# EAGLE design main (EAGLE 9.2.0)
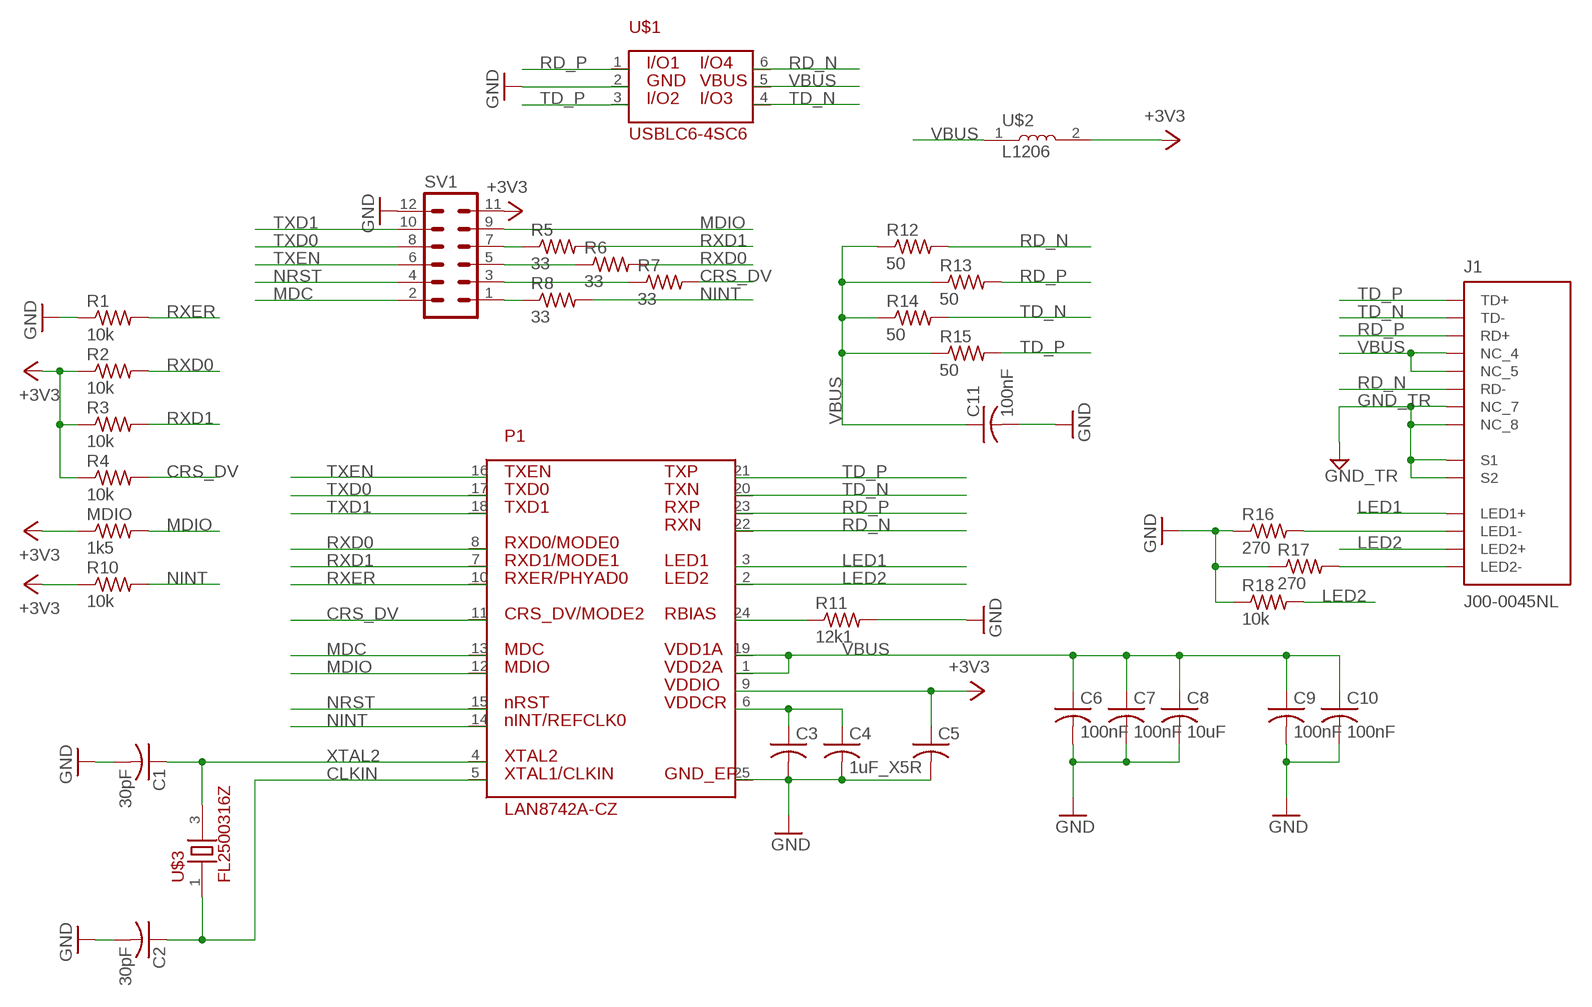
[diagram p0: schematic, sheet 1]

## Parts
C1  30pF  C-USC0603  [C0603]
C2  30pF  C-USC0603  [C0603]
C3  C-USC0603  [C0603]
C4  1uF_X5R  C-USC0603  [C0603]
C5  C-USC0603  [C0603]
C6  100nF  C-USC0603  [C0603]
C7  100nF  C-USC0603  [C0603]
C8  10uF  C-USC1206K  [C1206K]
C9  100nF  C-USC0603  [C0603]
C10  100nF  C-USC0603  [C0603]
C11  100nF  C-USC0603  [C0603]
J1  J00-0045NL  [PULSE_J00-0045NL]
MDIO  1k5  R-US_R0603  [R0603]
P1  LAN8742A-CZ  [LAN8742A-CZ]
R1  10k  R-US_R0603  [R0603]
R2  10k  R-US_R0603  [R0603]
R3  10k  R-US_R0603  [R0603]
R4  10k  R-US_R0603  [R0603]
R5  33  R-US_R0603  [R0603]
R6  33  R-US_R0603  [R0603]
R7  33  R-US_R0603  [R0603]
R8  33  R-US_R0603  [R0603]
R10  10k  R-US_R0603  [R0603]
R11  12k1  R-US_R0603  [R0603]
R12  50  R-US_R0603  [R0603]
R13  50  R-US_R0603  [R0603]
R14  50  R-US_R0603  [R0603]
R15  50  R-US_R0603  [R0603]
R16  270  R-US_R0603  [R0603]
R17  270  R-US_R0603  [R0603]
R18  10k  R-US_R0603  [R0603]
SV1  MA06-2  [MA06-2]
U$1  USBLC6-4SC6  [SOT95P280X145-6N]
U$2  L1206  [RESC3216X125N]
U$3  FL2500316Z  [FL2500316Z]

## Nets
+3V3 [power]: C5.1 MDIO.1 P1.9 R2.1 R3.1 R4.1 R10.1 SV1.11 U$2.2
CLKIN: C2.1 P1.5 U$3.1
CRS_DV: P1.11 R4.2 R7.2
GND [power]: C1.2 C2.2 C3.2 C4.2 C5.2 C6.2 C7.2 C8.2 C9.2 C10.2 C11.2 P1.25 R1.1 R11.2 R16.1 R17.1 R18.1 SV1.12 U$1.2
GND_TR [power]: J1.7(NC_7) J1.8(NC_8) J1.S1 J1.S2
LED1: J1.9(LED1+) P1.3
LED2: J1.12(LED2+) P1.2 R18.2
MDC: P1.13 SV1.2
MDIO: MDIO.2 P1.12 SV1.9
N$1: R5.1 SV1.7
N$2: R6.1 SV1.5
N$3: P1.24 R11.1
N$4: R7.1 SV1.3
N$5: R8.1 SV1.1
N$6: C3.1 C4.1 P1.6
N$9: J1.10(LED1-) R16.2
N$10: J1.11(LED2-) R17.2
NINT: P1.14 R8.2 R10.2
NRST: P1.15 SV1.4
RD_N [diff pairs]: J1.6(RD-) P1.22 R12.2 U$1.6
RD_P [diff pairs]: J1.3(RD+) P1.23 R13.2 U$1.1
RXD0: P1.8 R2.2 R6.2
RXD1: P1.7 R3.2 R5.2
RXER: P1.10 R1.2
TD_N [diff pairs]: J1.2(TD-) P1.20 R14.2 U$1.4
TD_P [diff pairs]: J1.1(TD+) P1.21 R15.2 U$1.3
TXD0: P1.17 SV1.8
TXD1: P1.18 SV1.10
TXEN: P1.16 SV1.6
VBUS: C6.1 C7.1 C8.1 C9.1 C10.1 C11.1 J1.4(NC_4) J1.5(NC_5) P1.1 P1.19 R12.1 R13.1 R14.1 R15.1 U$1.5 U$2.1
XTAL2: C1.1 P1.4 U$3.3

## Library data of the parts
C1-C11 = resistor:C-US: CAPACITOR, American symbol
J1 = J00-0045NL:J00-0045NL: Conn RJ-45 Integrated Magnetics F 8 POS 2.54mm Solder RA Thru-Hole 12 Terminal 1 Port Cat 5/Cat 6; AVAILABILITY: Unavailable; DESCRIPTION: Conn RJ-45 Integrated Magnetics F 8 POS 2.54mm Solder RA Thru-Hole 12 Terminal 1 Port Cat 5/Cat 6; MF: Pulse Electronics; MP: J00-0045NL; PACKAGE: None; PRICE: None
MDIO R1-R8 R10-R18 = resistor:R-US_: RESISTOR, American symbol
P1 = LAN8742A-CZ:LAN8742A-CZ: 24-pin, high-performance 10/100 Ethernet transceiver, 3.3V supply; A_MAX: 1.0; A_MIN: 0.8; A_NOM: 0.9; B_MAX: 0.3; B_MIN: 0.18; B_NOM: 0.24; D2_MAX: 2.6; D2_MIN: 2.4; D2_NOM: 2.5; D_MAX: 4.1; D_MIN: 3.9; D_NOM: 4.0; E2_MAX: 2.6; E2_MIN: 2.4; E2_NOM: 2.5; ENOM: 0.5; E_MAX: 4.1; E_MIN: 3.9; E_NOM: 4.0; L_MAX: 0.45; L_MIN: 0.35; L_NOM: 0.4; MANUFACTURER: Microchip; PIN_COUNT_D: 6.0; PIN_COUNT_E: 6.0; SNAPEDA_PACKAGE_ID: 37385
SV1 = con-lstb:MA06-2: PIN HEADER; OC_FARNELL: unknown; OC_NEWARK: unknown
U$1 = SOT95P280X145-6N:USBLC6-4SC6: Very low capacitance ESD protection
U$2 = BLM15BA330SN1D:L1206
U$3 = ABM3-25.000MHZ-B2-T:FL2500316Z

## Net classes
0 default: width 0.152 mm
1 diff pairs: width 0.254 mm
2 power: width 0.762 mm

## Board
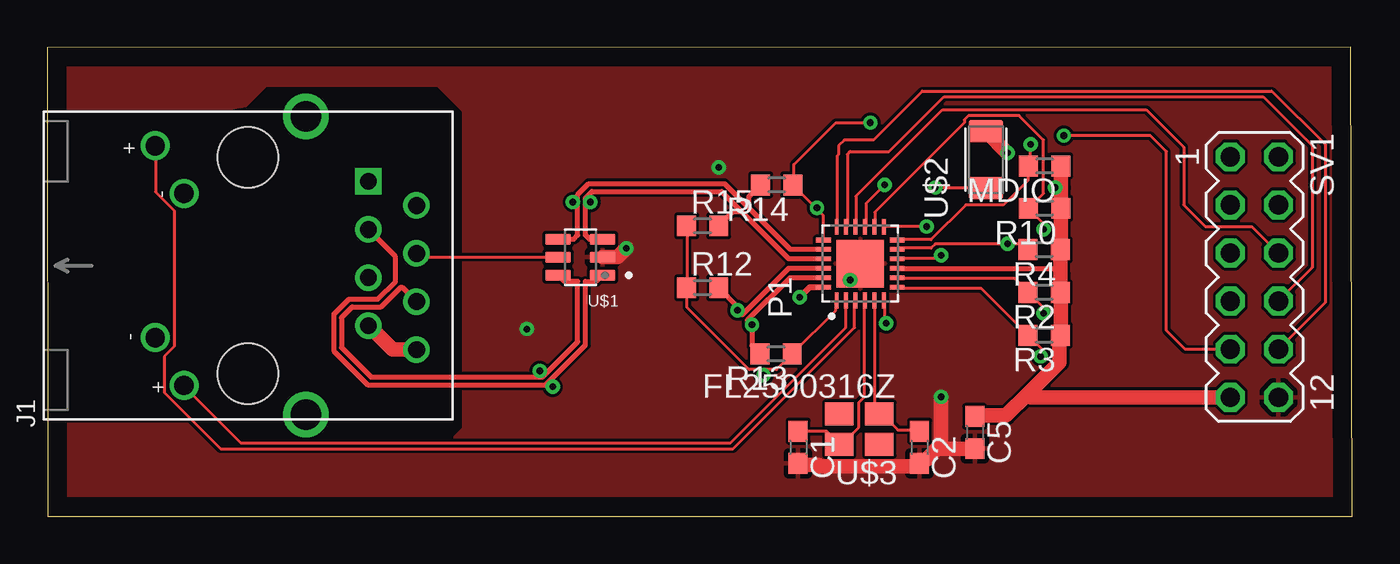
[diagram p1: board, top side]
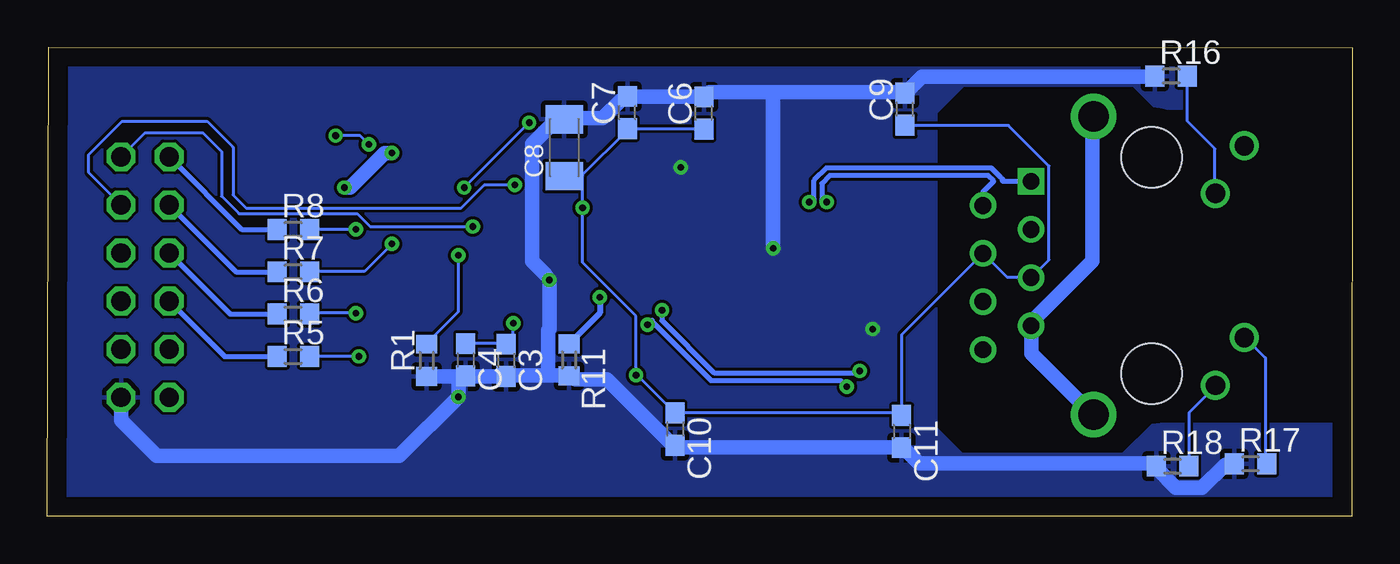
[diagram p2: board, bottom side, seen from below]

Size 68.86 x 24.76 mm. Coordinates in mm from the lower left corner, seen from the top.
Outline: 0.03,0 68.86,0 68.78,24.75 0,24.73 0.03,0
Copper layers (1*16): Top 0.035mm / dielectric 1.5mm / Bottom 0.035mm
Design rules "default": minimum track width 6mil, minimum drill 0.35mm, track to track 6mil, track to pad 6mil, pad to pad 6mil, via to via 6mil, smd to smd 6mil, copper to edge 40mil, drill to drill 6mil, minimum pad ring 10mil, minimum via ring 8mil, stop-mask expansion 4mil, vias tented up to drill 0mil, thermal gap 10mil

### Footprints (pad centres in the part's own frame; a part is rotated, then mirrored left to right if it is on the bottom)
C0603 = smd 1.1 x 1: 1 -0.85,0; 2 0.85,0
C1206K = smd 1.5 x 2: 1 -1.5,0; 2 1.5,0
PULSE_J00-0045NL = drill 0.89 square: 1 4.445,-6.35 | drill 0.89: 2 3.175,-8.89; 3 1.905,-6.35; 4 0.635,-8.89; 5 -0.635,-6.35; 6 -1.905,-8.89; 7 -3.175,-6.35; 8 -4.445,-8.89 | drill 1.02: 9 6.325,4.9; 10 3.81,3.38; 11 -3.81,4.9; 12 -6.325,3.38 | drill 1.6: S1 -7.875,-3.05; S2 7.875,-3.05 | hole 3.2: -5.715,0; 5.715,0
R0603 = smd 1 x 1.1: 1 -0.85,0; 2 0.85,0
LAN8742A-CZ = smd 0.84 x 0.26: 1 -1.945,1.25; 2 -1.945,0.75; 3 -1.945,0.25; 4 -1.945,-0.25; 5 -1.945,-0.75; 6 -1.945,-1.25; 13 1.945,-1.25; 14 1.945,-0.75; 15 1.945,-0.25; 16 1.945,0.25; 17 1.945,0.75; 18 1.945,1.25 | smd 0.26 x 0.84: 7 -1.25,-1.945; 8 -0.75,-1.945; 9 -0.25,-1.945; 10 0.25,-1.945; 11 0.75,-1.945; 12 1.25,-1.945; 19 1.25,1.945; 20 0.75,1.945; 21 0.25,1.945; 22 -0.25,1.945; 23 -0.75,1.945; 24 -1.25,1.945 | smd 2.5 x 2.5: 25 0,0
MA06-2 = drill 1.016 octagon: 1 -6.35,-1.27; 2 -6.35,1.27; 3 -3.81,-1.27; 4 -3.81,1.27; 5 -1.27,-1.27; 6 -1.27,1.27; 7 1.27,-1.27; 8 1.27,1.27; 9 3.81,-1.27; 10 3.81,1.27; 11 6.35,-1.27; 12 6.35,1.27
SOT95P280X145-6N = smd 1.36 x 0.6: 1 -1.175,0.95; 2 -1.175,0; 3 -1.175,-0.95; 4 1.175,-0.95; 5 1.175,0; 6 1.175,0.95
RESC3216X125N = smd 1.2 x 1.82: 1 -1.505,0; 2 1.505,0
FL2500316Z = smd 1.5 x 1.2: 1 -1.06,-0.8; 2 1.06,-0.8; 3 1.06,0.8; 4 -1.06,0.8

### Placement (x,y rotation side)
C1  39.62,3.63 270 top
C2  46.02,3.63 270 top
C3  44.65,8.23 270 bottom
C4  46.79,8.25 270 bottom
C5  48.95,4.42 270 top
C6  34.21,21.29 90 bottom
C7  38.25,21.31 90 bottom
C8  41.58,19.46 90 bottom
C9  23.6,21.49 90 bottom
C10  35.74,4.6 270 bottom
C11  23.77,4.47 270 bottom
J1  10.59,13.23 90 top
MDIO  52.63,18.49 180 top
P1  42.9,13.34 90 top
R1  48.84,8.23 90 bottom
R2  52.6,11.81 180 top
R3  52.6,9.55 180 top
R4  52.6,14.07 180 top
R5  55.88,8.43 0 bottom
R6  55.88,10.67 0 bottom
R7  55.88,12.9 0 bottom
R8  55.88,15.14 0 bottom
R10  52.63,16.26 180 top
R11  41.33,8.25 270 bottom
R12  34.58,12.06 0 top
R13  38.46,8.57 180 top
R14  38.49,17.49 180 top
R15  34.58,15.33 0 top
R16  9.55,23.24 0 bottom
R17  5.36,2.77 0 bottom
R18  9.47,2.64 0 bottom
SV1  63.7,12.62 270 top
U$1  28.13,13.68 180 top
U$2  49.53,18.82 90 top
U$3  42.85,4.6 180 top

### Tracks (layer width: path | path; a pad name or v marks a point on that pad's centre or on a via)
+3V3  (via drill 0.35)
  Top 0.254: P1.9 53.22,13.08 53.45,12.85
  Top 0.762: 51.74,6.45 53.42,8.13 53.42,9.5 R3.1 53.49,9.88 53.49,11.48 R2.1 53.45,12.85 R4.1 53.49,14.15 53.49,16.21 R10.1 53.49,16.59 53.49,17.35 | 51.74,6.45 50.6,5.31 49,5.31 C5.1 | 53.49,17.35 53.49,18.49 MDIO.1 | v50.67,19.18 U$2.2 | v53.19,17.35 53.49,17.35 | SV1.11 51.92,6.27 51.74,6.45
  Bottom 0.762: v50.67,19.18 51.05,19.18 52.88,17.35 v53.19,17.35
CLKIN
  Top 0.152: P1.5 43.66,11.33 43.66,5.69 43.89,5.46 U$3.1 43.97,5.46 44.88,4.55 46.02,4.55 C2.1
CRS_DV  (via drill 0.35)
  Top 0.152: P1.11 44.88,14.15 46.63,14.15 46.86,14.38 v50.67,14.38 51.44,14.38 R4.2
  Bottom 0.152: v50.67,14.38 52.12,12.93 55.02,12.93 R7.2
GND  (via drill 0.35)
  Top 0.762: v30.56,14.15 30.1,13.69 29.34,13.69 U$1.2 | C1.2 39.62,2.72 40.69,2.72 40.77,2.64 45.95,2.64 46.02,2.72 C2.2 46.33,2.95 46.94,3.56 47.17,3.56 | 47.17,3.56 48.92,3.56 C5.2 | v42.37,12.47 42.37,12.78 42.9,13.31 P1.25 | v47.17,6.3 47.17,3.56
  Bottom 0.762: 30.56,22.38 33.91,22.38 C6.2 34.21,22.15 38.25,22.15 C7.2 38.56,22 39.55,21.01 41.53,21.01 C8.2 41.91,20.78 42.14,20.78 43.28,19.63 43.28,13.46 42.6,12.78 v42.37,12.47 42.37,9.88 42.44,9.8 42.44,7.44 | 30.56,22.38 23.62,22.38 C9.2 23.32,22.61 22.71,23.22 10.44,23.22 R16.1 | 30.56,22.38 v30.56,14.15 | C4.2 46.79,7.37 44.65,7.37 C3.2 44.35,7.44 42.44,7.44 | R1.1 48.84,7.37 47.09,7.37 C4.2 | 42.44,7.44 41.38,7.44 R11.2 41,7.21 39.32,7.21 36.04,3.94 C10.2 35.74,3.71 35.66,3.63 23.77,3.63 C11.2 23.47,3.4 22.86,2.79 10.67,2.79 R18.1 10.29,2.64 10.29,2.49 9.3,1.5 7.92,1.5 6.71,2.72 6.25,2.72 R17.1 | C4.2 47.17,6.98 v47.17,6.3 50.29,3.17 63.09,3.17 64.97,5.05 SV1.12
  other vias: 35.43,18.41 25.3,9.88
  pour Bottom: 0.15,24.59 68.43,24.59 68.66,24.36 68.66,0.43 68.35,0.13 0.15,0.13 0.15,4.85 10.52,4.85 12.12,3.25 20.57,3.25 21.95,4.62 21.95,21.31 20.5,22.76 11.58,22.76 10.36,21.54 0.08,21.54 0.08,24.51
  pour Top: 0.15,4.7 0.15,0.2 0.3,0.05 68.5,0.05 68.81,0.36 68.81,24.21 68.43,24.59 0.23,24.59 0.15,24.51 0.08,24.43 0.08,21.54 10.36,21.54 11.58,22.76 20.57,22.76 21.95,21.39 21.95,4.62 20.57,3.25 12.12,3.25 10.52,4.85 0.15,4.85
GND_TR
  Top 0.762: J1.8 19.43,8.81 18.21,8.81 16.99,10.03 J1.7
  Bottom 0.762: J1.S1 13.72,5.38 16.92,8.59 16.92,10.03 J1.7 16.76,10.41 13.72,13.46 13.72,21.08 J1.S2
LED1
  Top 0.152: P1.3 42.6,11.33 42.6,9.96 36.2,3.56 9.14,3.56 6.17,6.53 6.17,8.43 6.71,8.97 6.71,16.13 5.72,17.12 5.72,19.56 J1.9
LED2
  Top 0.152: P1.2 42.14,11.33 42.14,9.96 36.04,3.86 10.21,3.86 7.24,6.83 J1.12
  Bottom 0.152: R18.2 8.61,5.46 7.24,6.83 J1.12
MDC  (via drill 0.35)
  Top 0.152: v46.41,15.29 44.2,15.29 P1.13
  Bottom 0.152: v46.41,15.29 51.82,15.29 52.5,15.98 58.75,15.98 59.66,16.89 59.66,19.25 60.66,20.24 63.7,20.24 SV1.2
MDIO  (via drill 0.35)
  Top 0.152: P1.12 44.88,14.6 46.63,14.6 48.46,16.43 50.44,16.43 51.74,17.73 51.74,18.49 MDIO.2 51.82,18.49 51.89,18.57 v51.89,19.63 | SV1.9 60.05,8.81 59.06,9.8 59.06,19.25 58.22,20.09 v53.64,20.09
  Bottom 0.152: v53.64,20.09 52.35,20.09 v51.89,19.63
N$1
  Bottom 0.254: SV1.7 59.51,8.43 R5.1
N$2
  Bottom 0.254: SV1.5 59.21,10.67 R6.1
N$3  (via drill 0.35)
  Top 0.305: P1.24 40.23,12.08 v39.7,11.56
  Bottom 0.305: v39.7,11.56 39.7,10.73 R11.1
N$4
  Bottom 0.254: SV1.3 58.9,12.9 R7.1
N$5
  Bottom 0.254: SV1.1 58.6,15.14 R8.1
N$6  (via drill 0.35)
  Top 0.152: v44.27,10.19 44.2,10.26 44.2,11.33 P1.6
  Bottom 0.152: v44.27,10.19 44.27,9.5 44.65,9.12 | 44.65,9.12 46.79,9.12 C4.1 | 44.65,9.12 C3.1
N$9
  Bottom 0.152: R16.2 8.69,23.22 8.69,20.85 7.24,19.41 7.24,17.04 J1.10
N$10
  Bottom 0.152: R17.2 4.57,2.79 4.57,8.36 5.64,9.42 J1.11
NINT  (via drill 0.35)
  Top 0.152: P1.14 43.66,15.29 43.66,16.05 48.39,20.78 48.39,20.93 48.62,21.16 51.28,21.16 52.58,19.86 52.58,17.04 51.82,16.28 R10.2 51.82,16.21 52.58,15.44 v52.58,15.14
  Bottom 0.152: v52.58,15.14 R8.2
NRST  (via drill 0.35)
  Top 0.152: v44.2,17.5 43.21,16.51 43.21,15.29 P1.15
  Bottom 0.152: v44.2,17.5 45.8,17.5 47.02,16.28 58.37,16.28 59.06,16.97 59.06,19.48 60.43,20.85 64.92,20.85 66.68,19.1 66.68,18.14 SV1.4
RD_N  (via drill 0.35)
  Top 0.254: P1.22 39.11,13.08 36.66,10.63 v36.42,10.87 36.42,11.07 R12.2 | 26.06,7.34 17.08,7.34 15.52,8.9 15.52,10.48 16.09,11.05 17.61,11.05 18.66,12.1 18.71,12.1 J1.6 | 26.06,7.34 26.13,7.34 27.99,9.2 27.99,12.4 27.29,12.4 U$1.6 | v25.98,7.67 25.98,7.42 26.06,7.34
  Bottom 0.254: v36.42,10.87 36.42,10.32 33.67,7.57 26.09,7.57 v25.98,7.67
RD_P  (via drill 0.35)
  Top 0.254: P1.23 39.19,12.58 36.95,10.35 v37.19,10.11 37.19,9 R13.2 | 26.43,7.07 26.3,6.93 16.91,6.93 15.11,8.73 15.11,10.65 15.92,11.46 17.44,11.46 18.37,12.39 18.37,13.71 J1.3 | 26.43,7.07 28.4,9.03 28.4,12.4 28.97,12.4 U$1.1 | v26.67,6.83 26.43,7.07
  Bottom 0.254: 36.95,10.34 36.95,10.35 | 36.95,10.34 36.95,10.27 33.84,7.16 27,7.16 v26.67,6.83 | v37.19,10.11 37.18,10.11 36.95,10.34
RXD0  (via drill 0.35)
  Top 0.152: P1.8 44.88,12.55 51.05,12.55 51.74,11.86 R2.2 51.82,11.79 52.58,11.02 v52.58,10.72
  Bottom 0.152: v52.58,10.72 55.02,10.72 R6.2
RXD1  (via drill 0.35)
  Top 0.152: P1.7 44.88,12.01 49.3,12.01 51.74,9.58 R3.2 51.82,9.5 52.43,8.89 v52.43,8.43
  Bottom 0.152: v52.43,8.43 R5.2
RXER  (via drill 0.35)
  Top 0.152: v47.17,13.77 47.02,13.61 44.88,13.61 P1.10
  Bottom 0.152: v47.17,13.77 47.17,10.79 48.84,9.12 R1.2
TD_N  (via drill 0.35)
  Top 0.254: P1.20 39.21,14.08 37.02,16.27 | 37.02,16.27 37.02,16.87 R14.2 | U$1.4 27.79,14.63 27.99,14.83 27.99,16.59 | 27.99,16.59 27.99,16.98 28.57,17.55 35.75,17.55 37.02,16.27 | v27.74,16.59 27.99,16.59
  Bottom 0.254: J1.2 19.48,17.12 18.91,17.69 19.21,17.98 27.58,17.98 27.99,17.57 27.99,16.74 27.84,16.59 v27.74,16.59
TD_P  (via drill 0.35)
  Top 0.254: P1.21 39.14,13.58 36.66,16.06 | 36.66,16.06 36.16,16.06 R15.2 | U$1.3 28.6,14.63 28.4,14.83 28.4,16.59 | 28.4,16.59 28.4,16.81 28.74,17.14 35.58,17.14 36.66,16.06 | v28.65,16.59 28.4,16.59
  Bottom 0.254: J1.1 18.42,17.68 18.47,17.73 18.44,17.81 18.53,17.87 19.04,18.39 27.74,18.39 28.4,17.74 28.4,16.74 28.55,16.59 v28.65,16.59
TXD0
  Top 0.152: P1.17 42.21,15.29 42.21,19.1 42.37,19.25 44.42,19.25 47.32,22.15 64.16,22.15 66.75,19.56 66.75,13.13 SV1.8
TXD1
  Top 0.152: P1.18 41.68,15.29 41.68,19.02 41.76,19.1 41.76,19.56 42.06,19.86 43.59,19.86 46.18,22.45 64.62,22.45 67.44,19.63 67.44,11.28 SV1.10
TXEN
  Top 0.152: P1.16 42.67,15.29 42.67,16.89 47.24,21.46 57.99,21.46 59.97,19.48 59.97,16.43 61.11,15.29 63.58,15.29 SV1.6
VBUS  (via drill 0.35)
  Top 0.152: 40.58,16.24 39.4,17.42 R14.1 39.4,17.5 39.4,18.57 41.61,20.78 v43.43,20.78 | 40.58,16.24 40.92,15.9 40.92,14.6 P1.19 | v46.86,17.35 49.53,17.35 U$2.1 | R15.1 33.76,15.29 33.76,12.09 R12.1 33.76,12.01 33.76,11.02 37.03,7.75 37.8,7.75 | P1.1 41.61,11.33 41.61,10.87 39.32,8.59 R13.1 39.24,8.51 38.48,7.75 37.8,7.75 | J1.4 19.66,13.69 26.9,13.69 U$1.5 | v37.8,7.44 37.8,7.75 | v40.61,16.28 40.58,16.24
  Bottom 0.152: C9.1 23.55,20.62 18.14,20.62 16,18.49 16,13.54 J1.5 16.99,12.62 18.21,12.62 19.43,13.84 J1.4 23.77,9.58 23.77,5.46 | v43.43,20.78 v46.86,17.35 | C6.1 34.21,20.47 38.25,20.47 C7.1 38.25,20.4 40.69,17.96 41.53,17.96 C8.1 40.61,17.96 v40.61,16.28 40.61,13.39 37.8,10.57 37.8,7.52 37.76,7.48 | 23.77,5.46 C11.1 23.77,5.38 | 23.77,5.46 C10.1 | C10.1 37.76,7.48 | C10.1 | v37.8,7.44 37.76,7.48
XTAL2
  Top 0.152: P1.4 43.13,11.33 43.13,6.3 42.82,5.99 42.82,4.7 41.99,3.86 41.83,3.86 U$3.3 41.76,3.86 41.15,4.47 C1.1